# Altium schematic sheet Sheet_1_2025-01-15.schdoc
size 560 x 414 mm
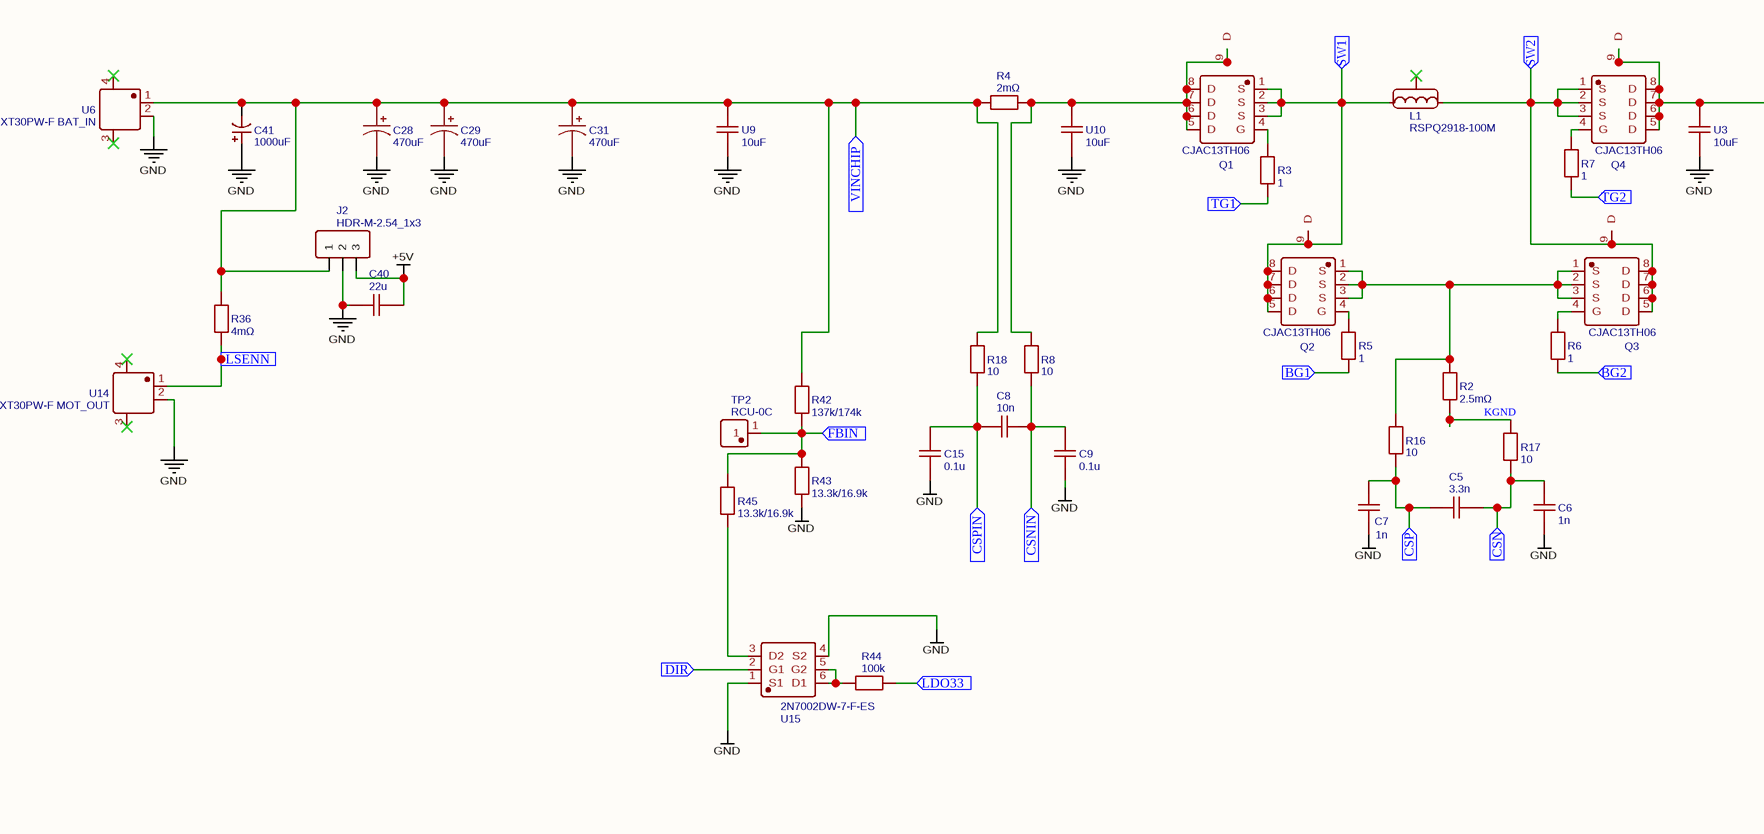
[diagram p0: Sheet_1_2025-01-15.schdoc, top left]
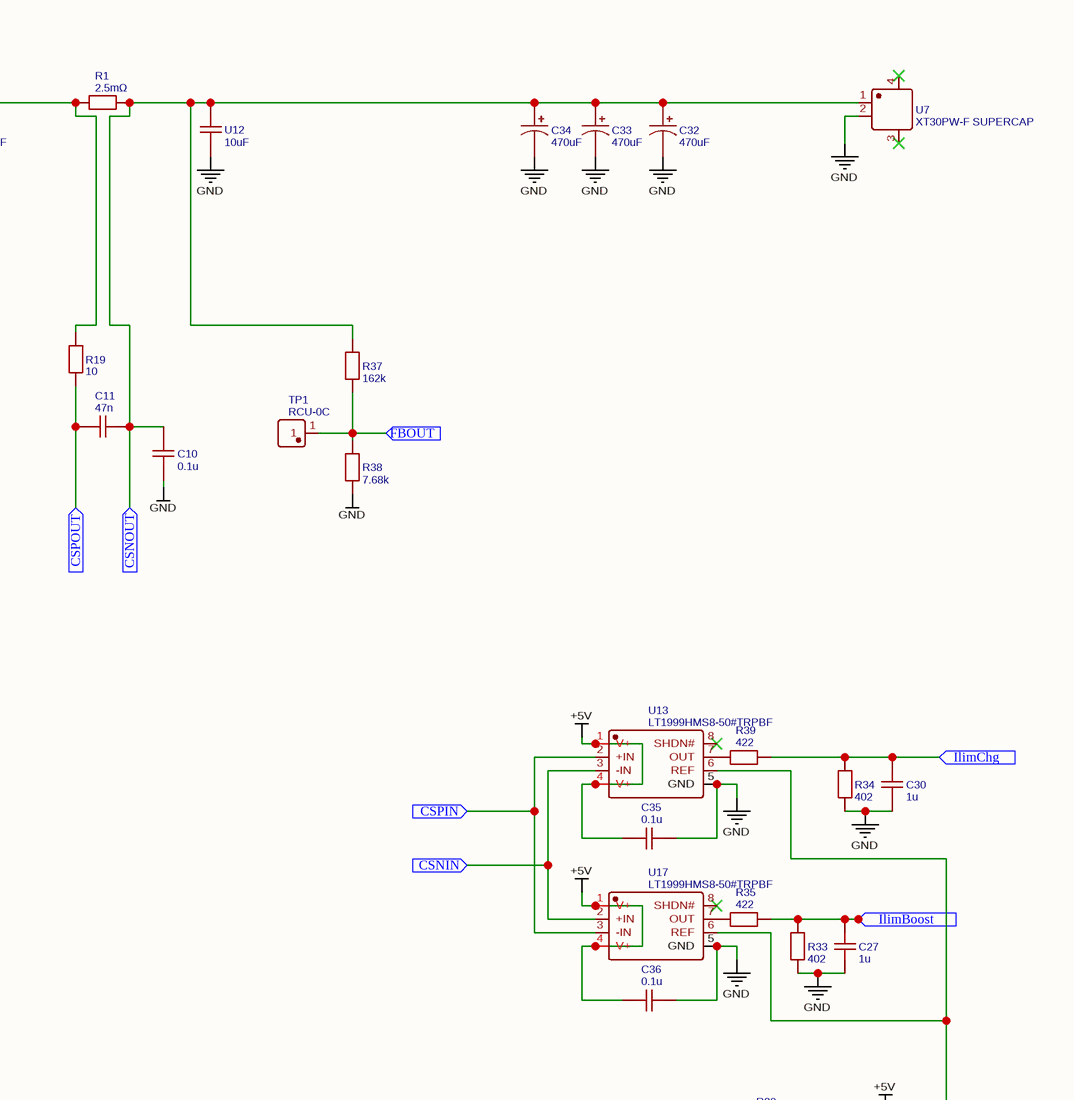
[diagram p1: Sheet_1_2025-01-15.schdoc, top right]
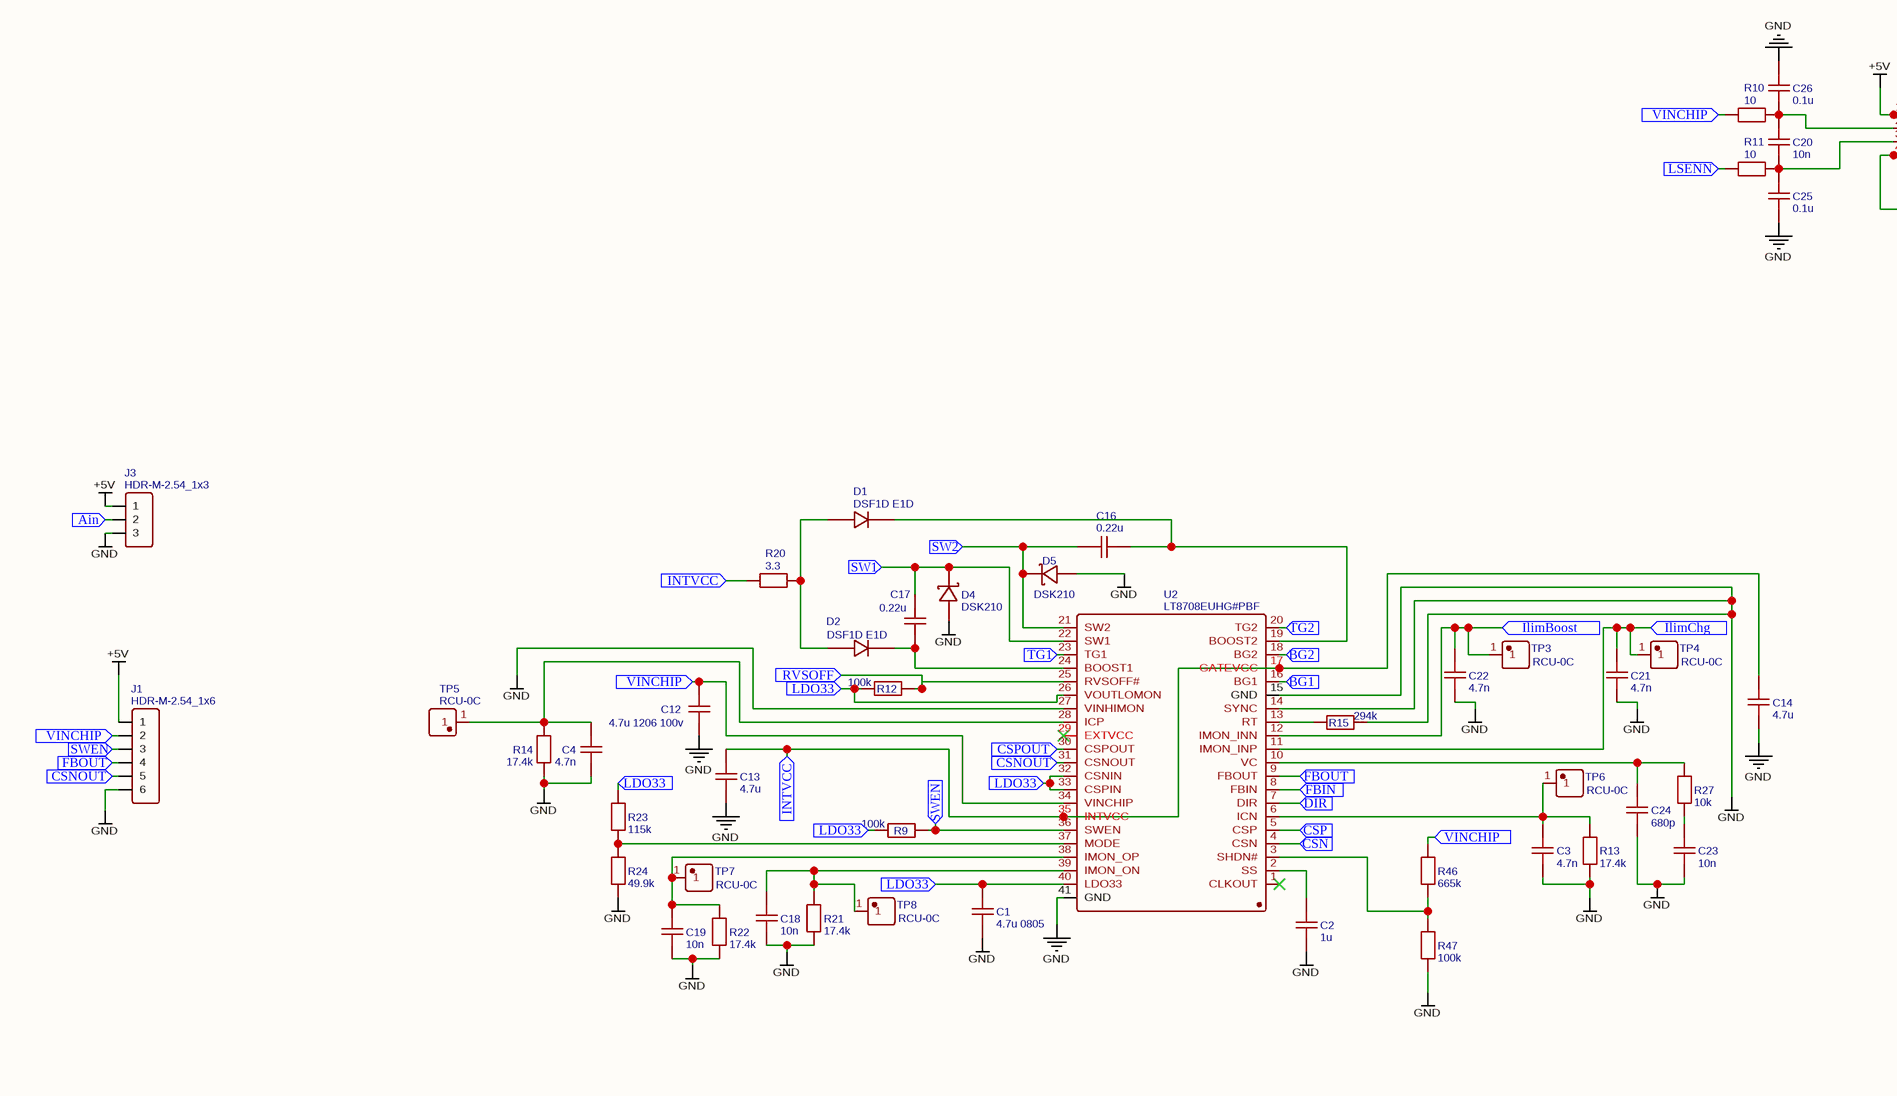
[diagram p2: Sheet_1_2025-01-15.schdoc, bottom left]
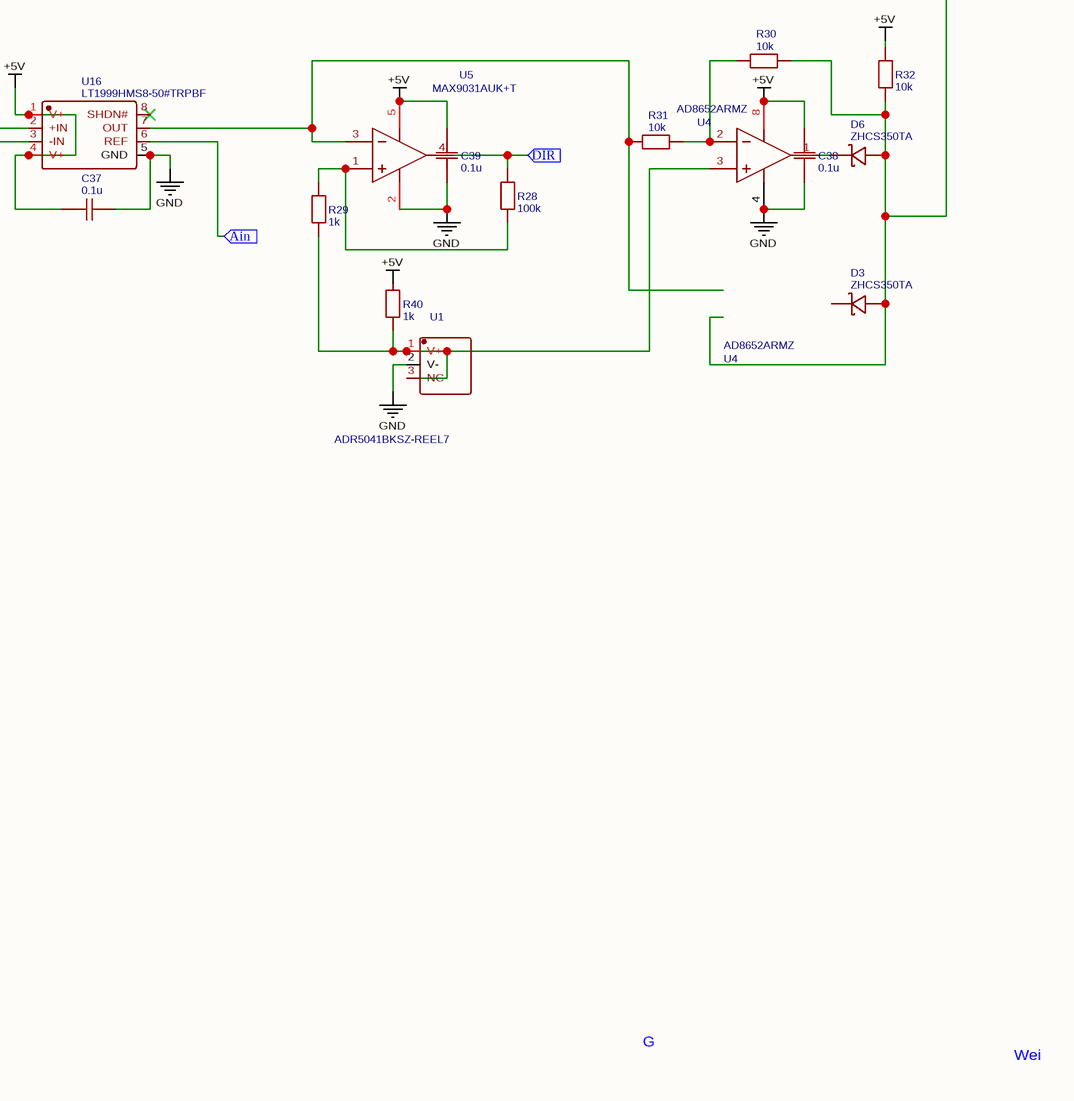
[diagram p3: Sheet_1_2025-01-15.schdoc, bottom right]

## Parts
(Parts that share a designator on the sheet are numbered #1, #2 ... from top to bottom, then left to right.)
C1  4.7u 0805  [C0805]
C2  1u  [C0603]
C3  4.7n  [C0603]
C4  4.7n  [C0603]
C5  3.3n  [C0603]
C6  1n  [C0603]
C7  1n  [C0603]
C8  10n  [C0603]
C9  0.1u  [C0603]
C10  0.1u  [C0603]
C11  47n  [C0603]
C12  4.7u 1206 100v  [C1206]
C13  4.7u  [C0603]
C14  4.7u  [C0603]
C15  0.1u  [C0603]
C16  0.22u  [C0603]
C17  0.22u  [C0603]
C18  10n  [C0603]
C19  10n  [C0603]
C20  10n  [C0603]
C21  4.7n  [C0603]
C22  4.7n  [C0603]
C23  10n  [C0603]
C24  680p  [C0603]
C25  0.1u  [C0603]
C26  0.1u  [C0603]
C27  1u  [C0603]
C28  470uF  [CAP-SMD_BD10.0-L10.3-W10.3-FD]
C29  470uF  [CAP-SMD_BD10.0-L10.3-W10.3-FD]
C30  1u  [C0603]
C31  470uF  [CAP-SMD_BD10.0-L10.3-W10.3-FD]
C32  470uF  [CAP-SMD_BD10.0-L10.3-W10.3-FD]
C33  470uF  [CAP-SMD_BD10.0-L10.3-W10.3-FD]
C34  470uF  [CAP-SMD_BD10.0-L10.3-W10.3-FD]
C35  0.1u  [C0603]
C36  0.1u  [C0603]
C37  0.1u  [C0603]
C38  0.1u  [C0603]
C39  0.1u  [C0603]
C40  22u  [C1206]
C41  1000uF  [CAP-TH_BD12.5-P5.00-D0.8-FD-1]
D1  DSF1D E1D  [SOD-123_L2.8-W1.8-LS3.7-RD]
D2  DSF1D E1D  [SOD-123_L2.8-W1.8-LS3.7-RD]
D3  ZHCS350TA  [SOD-523_L1.2-W0.8-LS1.6-RD]
D4  DSK210  [SOD-123FL_L2.7-W1.8-LS3.8-RD]
D5  DSK210  [SOD-123FL_L2.7-W1.8-LS3.8-RD]
D6  ZHCS350TA  [SOD-523_L1.2-W0.8-LS1.6-RD]
J1  HDR-M-2.54_1x6  [HDR-M-2.54_1X6]
J2  HDR-M-2.54_1x3  [HDR-M-2.54_1X3]
J3  HDR-M-2.54_1x3  [HDR-M-2.54_1X3]
L1  RSPQ2918-100M  [IND-SMD_3P-L27.9-W19.7-P10.43-LS27.9-BL-A]
Q1  CJAC13TH06  [PDFN-8_L5.8-W4.9-P1.27-LS6.1-BL]
Q2  CJAC13TH06  [PDFN-8_L5.8-W4.9-P1.27-LS6.1-BL]
Q3  CJAC13TH06  [PDFN-8_L5.8-W4.9-P1.27-LS6.1-BL]
Q4  CJAC13TH06  [PDFN-8_L5.8-W4.9-P1.27-LS6.1-BL]
R1  2.5mΩ  [R1225]
R2  2.5mΩ  [R1225]
R3  1  [R0603]
R4  2mΩ  [R1225]
R5  1  [R0603]
R6  1  [R0603]
R7  1  [R0603]
R8  10  [R0603]
R9  100k  [R0603]
R10  10  [R0603]
R11  10  [R0603]
R12  100k  [R0603]
R13  17.4k  [R0603]
R14  17.4k  [R0603]
R15  294k  [R0603]
R16  10  [R0603]
R17  10  [R0603]
R18  10  [R0603]
R19  10  [R0603]
R20  3.3  [R0603]
R21  17.4k  [R0603]
R22  17.4k  [R0603]
R23  115k  [R0603]
R24  49.9k  [R0603]
R27  10k  [R0603]
R28  100k  [R0603]
R29  1k  [R0603]
R30  10k  [R0603]
R31  10k  [R0603]
R32  10k  [R0603]
R33  402  [R0603]
R34  402  [R0603]
R35  422  [R0603]
R36  4mΩ  [R1225]
R37  162k  [R0603]
R38  7.68k  [R0603]
R39  422  [R0603]
R40  1k  [R0603]
R42  137k/174k  [R0603]
R43  13.3k/16.9k  [R0603]
R44  100k  [R0603]
R45  13.3k/16.9k  [R0603]
R46  665k  [R0603]
R47  100k  [R0603]
TP1  RCU-0C  [TESTPOINT-SMD_L1.6-W0.8_RCU-0C]
TP2  RCU-0C  [TESTPOINT-SMD_L1.6-W0.8_RCU-0C]
TP3  RCU-0C  [TESTPOINT-SMD_L1.6-W0.8_RCU-0C]
TP4  RCU-0C  [TESTPOINT-SMD_L1.6-W0.8_RCU-0C]
TP5  RCU-0C  [TESTPOINT-SMD_L1.6-W0.8_RCU-0C]
TP6  RCU-0C  [TESTPOINT-SMD_L1.6-W0.8_RCU-0C]
TP7  RCU-0C  [TESTPOINT-SMD_L1.6-W0.8_RCU-0C]
TP8  RCU-0C  [TESTPOINT-SMD_L1.6-W0.8_RCU-0C]
U1  ADR5041BKSZ-REEL7  [SC-70-3_L2.0-W1.3-P1.30-LS2.1-BR]
U2  LT8708EUHG#PBF  [QFN-40_L8.0-W5.0-P0.50-TL-EP_ADI_UHG]
U3  10uF  [C2220]
U4#1  AD8652ARMZ  [MSOP-8_L3.0-W3.0-P0.65-LS5.0-BL]
U4#2  AD8652ARMZ  [MSOP-8_L3.0-W3.0-P0.65-LS5.0-BL]
U5  MAX9031AUK+T  [SOT-23-5_L2.9-W1.6-P0.95-LS2.8-BL]
U6  XT30PW-F BAT_IN  [CONN-TH_XT30PW-F-1]
U7  XT30PW-F SUPERCAP  [CONN-TH_XT30PW-F-1]
U9  10uF  [C2220]
U10  10uF  [C2220]
U12  10uF  [C2220]
U13  LT1999HMS8-50#TRPBF  [MSOP-8_L3.0-W3.0-P0.65-LS4.9-BL]
U14  XT30PW-F MOT_OUT  [CONN-TH_XT30PW-F-1]
U15  2N7002DW-7-F-ES  [SOT-363_L2.1-W1.3-P0.65-LS2.3-BL]
U16  LT1999HMS8-50#TRPBF  [MSOP-8_L3.0-W3.0-P0.65-LS4.9-BL]
U17  LT1999HMS8-50#TRPBF  [MSOP-8_L3.0-W3.0-P0.65-LS4.9-BL]

## Ports
Ain (in), BG1 (in), BG2 (in), CSN (in), CSNIN (in), CSNOUT (in), CSP (in), CSPIN (in), CSPOUT (in), DIR (in), FBIN (in), FBOUT (in), IlimBoost (in), IlimChg (in), INTVCC (in), LDO33 (in), LSENN (in), RVSOFF (in), SW1 (in), SW2 (in), SWEN (in), TG1 (in), TG2 (in), VINCHIP (in)

## Nets
+5V: C35.2 C36.2 C37.2 C38.2 C39.2 C40.2 J1.1 J2.3 J3.1 R32.2 R40.2 U4#1.8(V+) U5.5(VDD) U13.1(V+) U13.4(V+) U16.1(V+) U16.4(V+) U17.1(V+) U17.4(V+)
GND: C1.1 C2.1 C3.1 C4.1 C6.1 C7.1 C9.1 C10.1 C12.1 C13.1 C14.1 C15.1 C18.1 C19.1 C21.1 C22.1 C23.1 C24.1 C25.1 C26.2 C27.1 C28.2 C29.2 C30.1 C31.2 C32.2 C33.2 C34.2 C35.1 C36.1 C37.1 C38.1 C39.1 C40.1 C41.1 D4.2(A) D5.2(A) J1.6 J2.2 J3.3 R13.1 R14.1 R15.1 R21.1 R22.1 R24.1 R33.1 R34.1 R38.1 R43.2 R47.1 U1.2(V-) U2.14(SYNC) U2.15(GND) U2.27(VINHIMON) U2.41(GND) U3.1 U4#1.4(V-) U5.2(VSS) U6.2 U7.2 U9.1 U10.1 U12.1 U13.5(GND) U14.2 U15.1(S1) U15.4(S2) U16.5(GND) U17.5(GND)
Ain: J3.2 U16.6(REF) ; port Ain
BG1: R5.1 U2.16(BG1) ; port BG1
BG2: R6.1 U2.18(BG2) ; port BG2
CSN: C5.2 C6.2 R17.1 U2.4(CSN) ; port CSN
CSNIN: C8.2 C9.2 R8.1 U13.3(-IN) U17.2(+IN) ; port CSNIN
CSNOUT: C10.2 C11.2 C32.1 C33.1 C34.1 J1.5 R1.2 R37.2 U2.31(CSNOUT) U7.1 U12.2 ; port CSNOUT
CSP: C5.1 C7.2 R16.1 U2.5(CSP) ; port CSP
CSPIN: C8.1 C15.2 R18.1 U13.2(+IN) U17.3(-IN) ; port CSPIN
CSPOUT: C11.1 R19.1 U2.30(CSPOUT) ; port CSPOUT
DIR: R28.2 U2.7(DIR) U5.4(OUT) U15.2(G1) ; port DIR
FBIN: R42.2 R43.1 R45.1 TP2.1 U2.8(FBIN) ; port FBIN
FBOUT: J1.4 R37.1 R38.2 TP1.1 U2.9(FBOUT) ; port FBOUT
IlimBoost: C22.2 C27.2 R33.2 R35.2 TP3.1 U2.12(IMON_INN) ; port IlimBoost
IlimChg: C21.2 C30.2 R34.2 R39.2 TP4.1 U2.11(IMON_INP) ; port IlimChg
INTVCC: C13.2 C14.2 R20.1 U2.17(GATEVCC) U2.35(INTVCC) ; port INTVCC
KGND: R2.1 R17.2
LDO33: C1.2 R9.1 R12.1 R23.2 R44.2 U2.26(VOUTLOMON) U2.32(CSNIN) U2.33(CSPIN) U2.40(LDO33) ; port LDO33
LSENN: R11.1 R36.1 U14.1 ; port LSENN
RVSOFF: R12.2 U2.25(RVSOFF#) ; port RVSOFF
SW1: C17.2 D4.1(C) L1.1 Q1.1(S) Q1.2(S) Q1.3(S) Q2.5(D) Q2.6(D) Q2.7(D) Q2.8(D) Q2.9(D) U2.22(SW1) ; port SW1
SW2: C16.1 D5.1(C) L1.2 Q3.5(D) Q3.6(D) Q3.7(D) Q3.8(D) Q3.9(D) Q4.1(S) Q4.2(S) Q4.3(S) U2.21(SW2) ; port SW2
SWEN: J1.3 R9.2 U2.36(SWEN) ; port SWEN
TG1: R3.1 U2.23(TG1) ; port TG1
TG2: R7.1 U2.20(TG2) ; port TG2
VINCHIP: C12.2 C28.1 C29.1 C31.1 C41.2 J1.2 J2.1 R4.1 R10.1 R18.2 R36.2 R42.1 R46.2 U2.34(VINCHIP) U6.1 U9.2 ; port VINCHIP
NetC2_2: C2.2 U2.2(SS)
NetC3_2: C3.2 R13.2 TP6.1 U2.6(ICN)
NetC4_2: C4.2 R14.2 TP5.1 U2.28(ICP)
NetC16_2: C16.2 D1.1 U2.19(BOOST2)
NetC17_1: C17.1 D2.1 U2.24(BOOST1)
NetC18_2: C18.2 R21.2 TP8.1 U2.39(IMON_ON)
NetC19_2: C19.2 R22.2 TP7.1 U2.38(IMON_OP)
NetC20_1: C20.1 C25.2 R11.2 U16.3(-IN)
NetC20_2: C20.2 C26.1 R10.2 U16.2(+IN)
NetC23_2: C23.2 R27.1
NetC24_2: C24.2 R27.2 U2.10(VC)
NetD1_2: D1.2 D2.2 R20.2
NetD3_2: D3.2(A) D6.2(A) R30.1 R32.1 U13.6(REF) U17.6(REF)
NetD6_1: D6.1(C) U4#1.1(OUT_A)
NetQ1_4: Q1.4(G) R3.2
NetQ1_5: Q1.5(D) Q1.6(D) Q1.7(D) Q1.8(D) Q1.9(D) R4.2 R8.2 U10.2
NetQ2_1: Q2.1(S) Q2.2(S) Q2.3(S) Q3.1(S) Q3.2(S) Q3.3(S) R2.2 R16.2
NetQ2_4: Q2.4(G) R5.2
NetQ3_4: Q3.4(G) R6.2
NetQ4_4: Q4.4(G) R7.2
NetQ4_5: Q4.5(D) Q4.6(D) Q4.7(D) Q4.8(D) Q4.9(D) R1.1 R19.2 U3.2
NetR15_2: R15.2 U2.13(RT)
NetR23_1: R23.1 R24.2 U2.37(MODE)
NetR28_1: R28.1 R29.2 U5.1(+IN)
NetR29_1: R29.1 R40.1 U1.1(V+) U1.3(NC) U4#1.3(+IN_A)
NetR30_2: R30.2 R31.1 U4#1.2(–IN_A)
NetR31_2: R31.2 U5.3(-IN) U16.7(OUT)
NetR35_1: R35.1 U17.7(OUT)
NetR39_1: R39.1 U13.7(OUT)
NetR44_1: R44.1 U15.5(G2) U15.6(D1)
NetR45_2: R45.2 U15.3(D2)
NetR46_1: R46.1 R47.2 U2.3(SHDN#)

Not connected (* = marked no-connect by the designer): D3 1(C); L1 3(NC)*; U2 1(CLKOUT)* 29(EXTVCC)*; U6 3* 4*; U7 3* 4*; U13 8(SHDN#)*; U14 3* 4*; U16 8(SHDN#)*; U17 8(SHDN#)*

## Notes on the sheet
- G
- Wei

## Library data of the parts
C1 = 4.7u 0805: nameAlias: Value(F); Contributor: LCEDA_Lib; spicePre: C; spiceSymbolName: C_0805_US
C2 C27 C30 = 1u: nameAlias: Value(F); Contributor: LCEDA_Lib; spicePre: C; spiceSymbolName: C_0603_US
C3 C4 C21 C22 = 4.7n: nameAlias: Value(F); Contributor: LCEDA_Lib; spicePre: C; spiceSymbolName: C_0603_US
C5 = 3.3n: nameAlias: Value(F); Contributor: LCEDA_Lib; spicePre: C; spiceSymbolName: C_0603_US
C6 C7 = 1n: nameAlias: Value(F); Contributor: LCEDA_Lib; spicePre: C; spiceSymbolName: C_0603_US
C8 C18-C20 C23 = 10n: nameAlias: Value(F); Contributor: LCEDA_Lib; spicePre: C; spiceSymbolName: C_0603_US
C9 C10 C15 C25 C26 C35-C39 = 0.1u: nameAlias: Value(F); Contributor: LCEDA_Lib; spicePre: C; spiceSymbolName: C_0603_US
C11 = 47n: nameAlias: Value(F); Contributor: LCEDA_Lib; spicePre: C; spiceSymbolName: C_0603_US
C12 = 4.7u 1206 100v: nameAlias: Value(F); Contributor: LCEDA_Lib; Package Display: No; spicePre: C; spiceSymbolName: C_0805_US
C13 C14 = 4.7u: nameAlias: Value(F); Contributor: LCEDA_Lib; spicePre: C; spiceSymbolName: C_0603_US
C16 C17 = 0.22u: nameAlias: Value(F); Contributor: LCEDA_Lib; spicePre: C; spiceSymbolName: C_0603_US
C24 = 680p: nameAlias: Value(F); Contributor: LCEDA_Lib; spicePre: C; spiceSymbolName: C_0603_US
C28 C29 C31-C34 = 470uF: Manufacturer: lelon(立隆); Manufacturer Part: VEJ471K1VTR-1012; nameAlias: Value; Contributor: LCSC; Supplier: LCSC; Supplier Part: C473412; JLCPCB Part Class: Extended Part; link: https://lcsc.com/eda_search?q=C473412&%26type=1&ref=editor; spicePre: C; spiceSymbolName: VEJ471K1VTR-1012
C40 = 22u: nameAlias: Value(F); Contributor: LCEDA_Lib; spicePre: C; spiceSymbolName: C_1206_US
C41 = 1000uF: Manufacturer: AISHI(艾华集团); Manufacturer Part: ERS1VM102W20OT; nameAlias: Value; Contributor: lcsc; Supplier: LCSC; Supplier Part: C5156477; JLCPCB Part Class: Extended Part; link: https://lcsc.com/eda_search?q=C5156477&%26type=1&ref=editor; spicePre: C; spiceSymbolName: ERS1VM102W20OT_C5156477
D1 D2 = DSF1D E1D: Manufacturer: MDD(辰达半导体); Supplier: LCSC; Manufacturer Part: DSF1D E1D; Supplier Part: C64909; JLCPCB Part Class: Extended Part; link: https://lcsc.com/eda_search?q=C64909&%26type=1&ref=editor; spicePre: D; spiceSymbolName: DSF1D E1D
D3 D6 = ZHCS350TA: Manufacturer: DIODES(美台); Contributor: LCSC; Supplier Part: C154768; Supplier: LCSC; Manufacturer Part: ZHCS350TA; JLCPCB Part Class: Extended Part; link: https://lcsc.com/eda_search?q=C154768&%26type=1&ref=editor; spicePre: D; spiceSymbolName: ZHCS350TA
D4 D5 = DSK210: Manufacturer: AnBon(安邦); Contributor: LCSC; Supplier: LCSC; Supplier Part: C541662; Manufacturer Part: DSK210; JLCPCB Part Class: Extended Part; link: https://lcsc.com/eda_search?q=C541662&%26type=1&ref=editor; spicePre: D; spiceSymbolName: DSK210
J1 = HDR-M-2.54_1x6: Contributor: LCEDA_Lib; Supplier Part: C190819; Supplier: LCSC; spicePre: J; spiceSymbolName: HDR-M-2.54_1x6
J2 J3 = HDR-M-2.54_1x3: Contributor: LCEDA_Lib; Supplier Part: C180248; Supplier: LCSC; spicePre: J; spiceSymbolName: HDR-M-2.54_1x3
L1 = RSPQ2918-100M: Manufacturer: Ruishen(瑞申电子); Contributor: lcsc; Supplier: LCSC; Supplier Part: C32712982; Manufacturer Part: RSPQ2918-100M; link: https://lcsc.com/eda_search?q=C32712982&%26type=1&ref=editor; spicePre: L; spiceSymbolName: RSPQ2918-100M
Q1-Q4 = CJAC13TH06: Manufacturer: CJ(江苏长电/长晶); Contributor: LCSC; Supplier: LCSC; Supplier Part: C504082; Manufacturer Part: CJAC13TH06; JLCPCB Part Class: Extended Part; link: https://lcsc.com/eda_search?q=C504082&%26type=1&ref=editor; spicePre: Q; spiceSymbolName: CJAC13TH06
R1 R2 = 2.5mΩ: Manufacturer: Ohmite; Manufacturer Part: FCSL64R002GER; nameAlias: Value; Contributor: LCSC; Supplier: LCSC; Supplier Part: C2484639; JLCPCB Part Class: Extended Part; link: https://lcsc.com/eda_search?q=C2484639&%26type=1&ref=editor; spicePre: R; spiceSymbolName: FCSL64R002GER
R3 R5-R7 = 1: nameAlias: Value(Ω); Contributor: LCEDA_Lib; spicePre: R; spiceSymbolName: R_0603_EU
R4 = 2mΩ: Manufacturer: Ohmite; Manufacturer Part: FCSL64R002GER; nameAlias: Value; Contributor: LCSC; Supplier: LCSC; Supplier Part: C2484639; JLCPCB Part Class: Extended Part; link: https://lcsc.com/eda_search?q=C2484639&%26type=1&ref=editor; spicePre: R; spiceSymbolName: FCSL64R002GER
R8 R10 R11 R16-R19 = 10: nameAlias: Value(Ω); Contributor: LCEDA_Lib; spicePre: R; spiceSymbolName: R_0603_EU
R9 R12 R28 R44 R47 = 100k: nameAlias: Value(Ω); Contributor: LCEDA_Lib; spicePre: R; spiceSymbolName: R_0603_EU
R13 R14 R21 R22 = 17.4k: nameAlias: Value(Ω); Contributor: LCEDA_Lib; spicePre: R; spiceSymbolName: R_0603_EU
R15 = 294k: nameAlias: Value(Ω); Contributor: LCEDA_Lib; spicePre: R; spiceSymbolName: R_0603_EU
R20 = 3.3: nameAlias: Value(Ω); Contributor: LCEDA_Lib; spicePre: R; spiceSymbolName: R_0603_EU
R23 = 115k: nameAlias: Value(Ω); Contributor: LCEDA_Lib; spicePre: R; spiceSymbolName: R_0603_EU
R24 = 49.9k: nameAlias: Value(Ω); Contributor: LCEDA_Lib; spicePre: R; spiceSymbolName: R_0603_EU
R27 R30-R32 = 10k: nameAlias: Value(Ω); Contributor: LCEDA_Lib; spicePre: R; spiceSymbolName: R_0603_EU
R29 R40 = 1k: nameAlias: Value(Ω); Contributor: LCEDA_Lib; spicePre: R; spiceSymbolName: R_0603_EU
R33 R34 = 402: nameAlias: Value(Ω); Contributor: LCEDA_Lib; spicePre: R; spiceSymbolName: R_0603_EU
R35 R39 = 422: nameAlias: Value(Ω); Contributor: LCEDA_Lib; spicePre: R; spiceSymbolName: R_0603_EU
R36 = 4mΩ: Manufacturer: Ohmite; Manufacturer Part: FCSL64R002GER; nameAlias: Value; Contributor: LCSC; Supplier: LCSC; Supplier Part: C2484639; JLCPCB Part Class: Extended Part; link: https://lcsc.com/eda_search?q=C2484639&%26type=1&ref=editor; spicePre: R; spiceSymbolName: FCSL64R002GER
R37 = 162k: nameAlias: Value(Ω); Contributor: LCEDA_Lib; spicePre: R; spiceSymbolName: R_0603_EU
R38 = 7.68k: nameAlias: Value(Ω); Contributor: LCEDA_Lib; spicePre: R; spiceSymbolName: R_0603_EU
R42 = 137k/174k: nameAlias: Value(Ω); Contributor: LCEDA_Lib; spicePre: R; spiceSymbolName: R_0603_EU
R43 R45 = 13.3k/16.9k: nameAlias: Value(Ω); Contributor: LCEDA_Lib; spicePre: R; spiceSymbolName: R_0603_EU
R46 = 665k: nameAlias: Value(Ω); Contributor: LCEDA_Lib; spicePre: R; spiceSymbolName: R_0603_EU
TP1-TP8 = RCU-0C: Manufacturer: null; Contributor: lcsc; Supplier: LCSC; Supplier Part: C9900019498; Manufacturer Part: RCU-0C; JLCPCB Part Class: Extended Part; link: https://lcsc.com/eda_search?q=C9900019498&%26type=1&ref=editor; spicePre: T; spiceSymbolName: RCU-0C
U1 = ADR5041BKSZ-REEL7: Manufacturer: ADI(亚德诺); Contributor: LCSC; Supplier: LCSC; Manufacturer Part: ADR5041BKSZ-REEL7; Supplier Part: C143900; JLCPCB Part Class: Extended Part; link: https://lcsc.com/eda_search?q=C143900&%26type=1&ref=editor; spicePre: U; spiceSymbolName: ADR5041BKSZ-REEL7
U2 = LT8708EUHG#PBF: Manufacturer: ADI(亚德诺); Contributor: lcsc; Supplier: LCSC; Supplier Part: C1530024; Manufacturer Part: LT8708EUHG#PBF; JLCPCB Part Class: Extended Part; link: https://lcsc.com/eda_search?q=C1530024&%26type=1&ref=editor; spicePre: U; spiceSymbolName: LT8708EUHG#PBF
U3 U9 U10 U12 = 10uF: Manufacturer: TDK; Manufacturer Part: CKG57NX7R1H106M500JH; Contributor: lcsc; nameAlias: Value; Supplier: LCSC; Supplier Part: C3843063; link: https://lcsc.com/eda_search?q=C3843063&%26type=1&ref=editor; spicePre: U; spiceSymbolName: CKG57NX7R1H106M500JH
U4#1 U4#2 = AD8652ARMZ: subpart_no: 1; Manufacturer: ADI(亚德诺); Supplier: LCSC; Supplier Part: C653084; Manufacturer Part: AD8652ARMZ; JLCPCB Part Class: Extended Part; link: https://lcsc.com/eda_search?q=C653084&%26type=1&ref=editor; spicePre: U; spiceSymbolName: AD8652ARMZ
U5 = MAX9031AUK+T: Manufacturer: ADI(亚德诺)/MAXIM(美信); Contributor: LCSC; Supplier: LCSC; Supplier Part: C2682714; Manufacturer Part: MAX9031AUK+T; JLCPCB Part Class: Extended Part; link: https://lcsc.com/eda_search?q=C2682714&%26type=1&ref=editor; spicePre: U; spiceSymbolName: MAX9031AUK+T
U6 = XT30PW-F BAT_IN: Manufacturer: AMASS(艾迈斯); Manufacturer Part: XT30PW-F20.G.Y; Contributor: LCSC; Supplier: LCSC; Supplier Part: C2913282; JLCPCB Part Class: Extended Part; link: https://lcsc.com/eda_search?q=C2913282&%26type=1&ref=editor; spicePre: U; spiceSymbolName: XT30PW-F
U7 = XT30PW-F SUPERCAP: Manufacturer: AMASS(艾迈斯); Manufacturer Part: XT30PW-F20.G.Y; Contributor: LCSC; Supplier: LCSC; Supplier Part: C2913282; JLCPCB Part Class: Extended Part; link: https://lcsc.com/eda_search?q=C2913282&%26type=1&ref=editor; spicePre: U; spiceSymbolName: XT30PW-F
U13 U16 U17 = LT1999HMS8-50#TRPBF: Manufacturer: ADI(亚德诺)/LINEAR; Contributor: LCSC; Supplier: LCSC; Supplier Part: C665983; Manufacturer Part: LT1999HMS8-50#TRPBF; JLCPCB Part Class: Extended Part; link: https://lcsc.com/eda_search?q=C665983&%26type=1&ref=editor; spicePre: U; spiceSymbolName: LT1999HMS8-50#TRPBF
U14 = XT30PW-F MOT_OUT: Manufacturer: AMASS(艾迈斯); Manufacturer Part: XT30PW-F20.G.Y; Contributor: LCSC; Supplier: LCSC; Supplier Part: C2913282; JLCPCB Part Class: Extended Part; link: https://lcsc.com/eda_search?q=C2913282&%26type=1&ref=editor; spicePre: U; spiceSymbolName: XT30PW-F
U15 = 2N7002DW-7-F-ES: Manufacturer: ElecSuper(静芯微); Contributor: lcsc; Supplier: LCSC; Supplier Part: C5224252; Manufacturer Part: 2N7002DW-7-F-ES; JLCPCB Part Class: Extended Part; link: https://lcsc.com/eda_search?q=C5224252&%26type=1&ref=editor; spicePre: U; spiceSymbolName: 2N7002DW-7-F-ES